# EAGLE design Main (EAGLE 9.1.3)
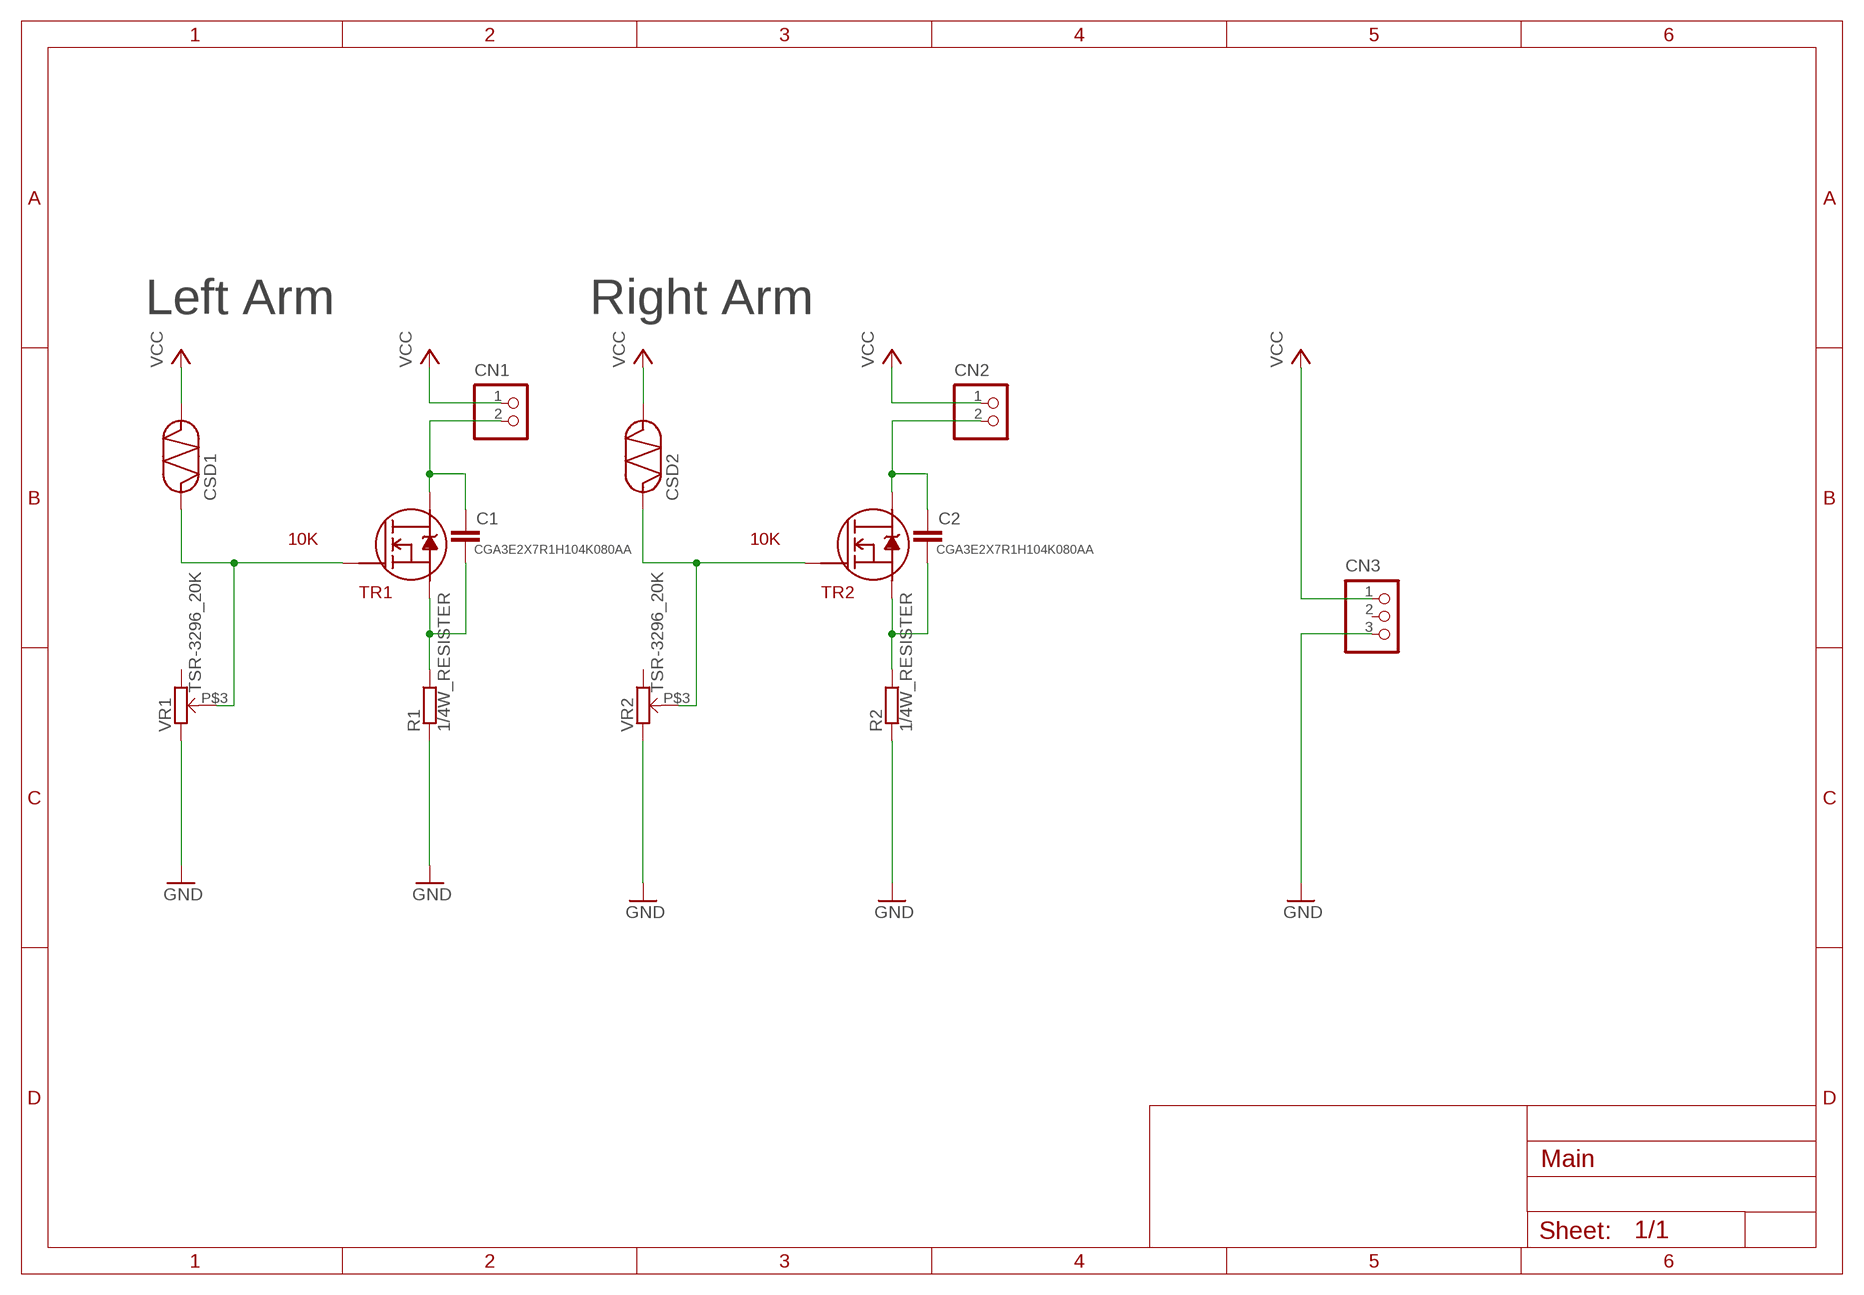
[diagram p0: schematic, sheet 1]

## Parts
C1  CGA3E2X7R1H104K080AA  [0603]
C2  CGA3E2X7R1H104K080AA  [0603]
CN1  B2B-XH-A  [B2B-XH-A]
CN2  B2B-XH-A  [B2B-XH-A]
CN3  B3B-XH-A  [B3B-XH-A]
CSD1  GL5528  [GL5528]
CSD2  GL5528  [GL5528]
R1  1/4W_RESISTER  [MF1/4]
R2  1/4W_RESISTER  [MF1/4]
TR1  RN5006  [SC-62]
TR2  RN5006  [SC-62]
VR1  TSR-3296_20K  [TSR-3296]
VR2  TSR-3296_20K  [TSR-3296]

## Nets
GND: CN3.3 R1.P$2 R2.P$2 VR1.P$2 VR2.P$2
N$1: C1.P$1 CN1.2 TR1.E(D)
N$2: C1.P$2 R1.P$1 TR1.C1(S) TR1.C2(S)
N$3: C2.P$1 CN2.2 TR2.E(D)
N$4: C2.P$2 R2.P$1 TR2.C1(S) TR2.C2(S)
N$8: CSD2.P$1 TR2.B(G) VR2.P$3
N$9: CSD1.P$1 TR1.B(G) VR1.P$3
VCC: CN1.1 CN2.1 CN3.1 CSD1.P$2 CSD2.P$2
Unconnected: CN3.2 VR1.P$1 VR2.P$1

## Notes on the sheet
- Left Arm | Right Arm
- 10K | 10K

## Library data of the parts
C1 C2 = TDK:CGA3E2X7R1H104K080AA: 0.1µF ±10% 50V セラミックコンデンサ X7R 0603（1608メートル法）
CN1 CN2 = jst-xh:B2B-XH-A: Wire-to-Board 2.5mm pitch top mount connector Source: http://www.jst-mfg.com/product/pdf/jpn/XH.pdf http://www.jst-mfg.com/product/detail.php?series=277
CN3 = jst-xh:B3B-XH-A: Wire-to-Board 2.5mm pitch top mount connector Source: http://www.jst-mfg.com/product/pdf/jpn/XH.pdf http://www.jst-mfg.com/product/detail.php?series=277
CSD1 CSD2 = Tr_EXT:GL5528
R1 R2 = Tr_EXT:1/4W_RESISTER
TR1 TR2 = Tr_EXT:RN5006
VR1 VR2 = Tr_EXT:TSR-3296_20K

## Board
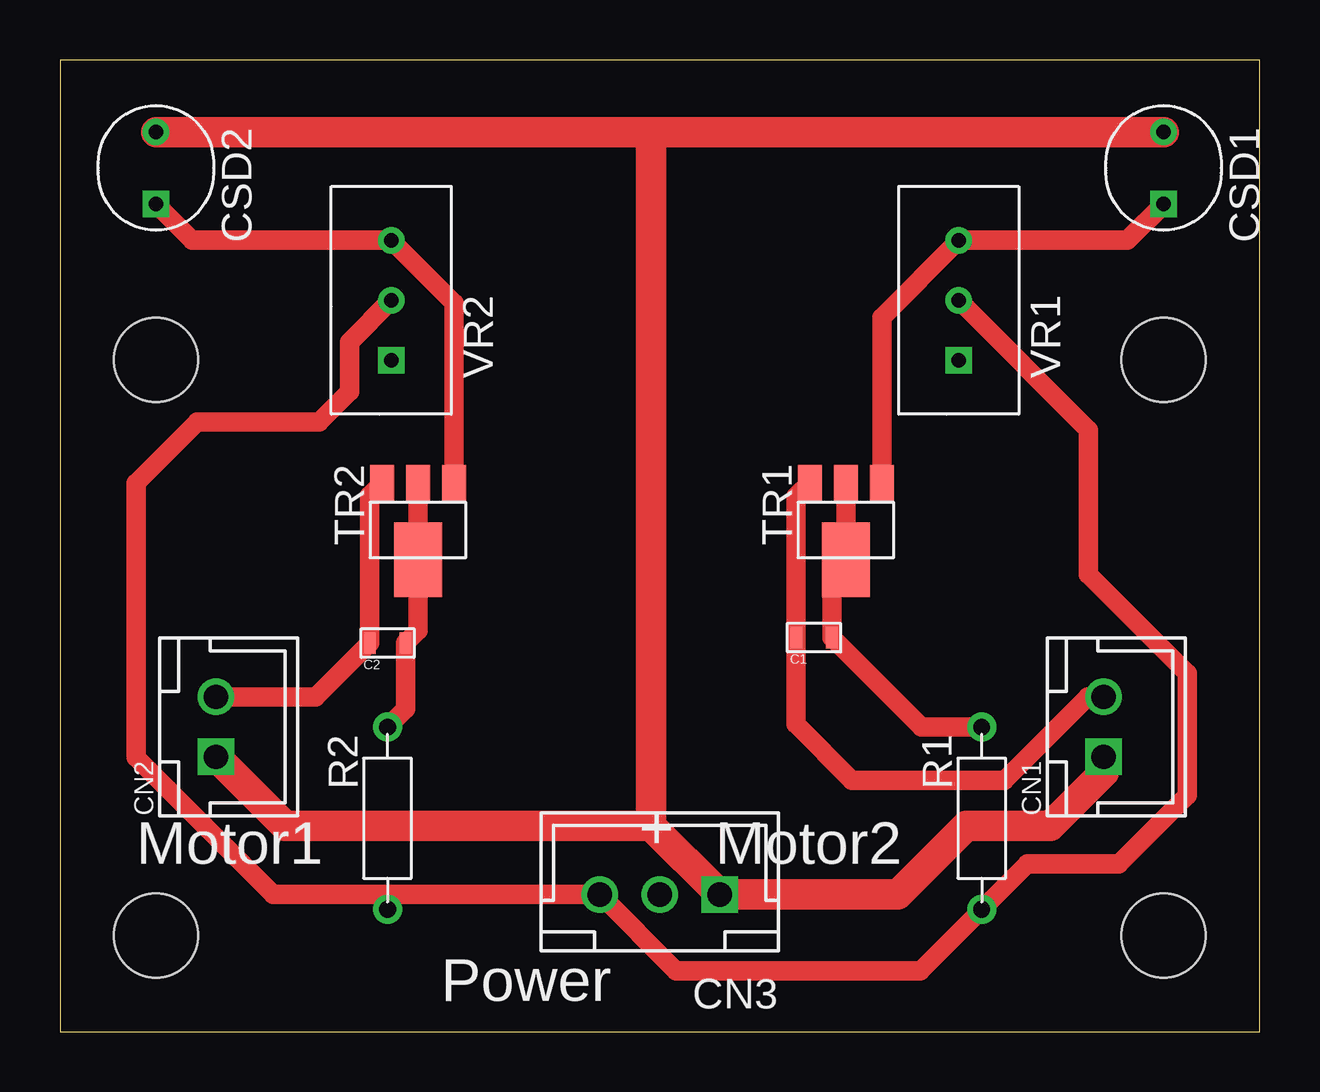
[diagram p1: board, top side]
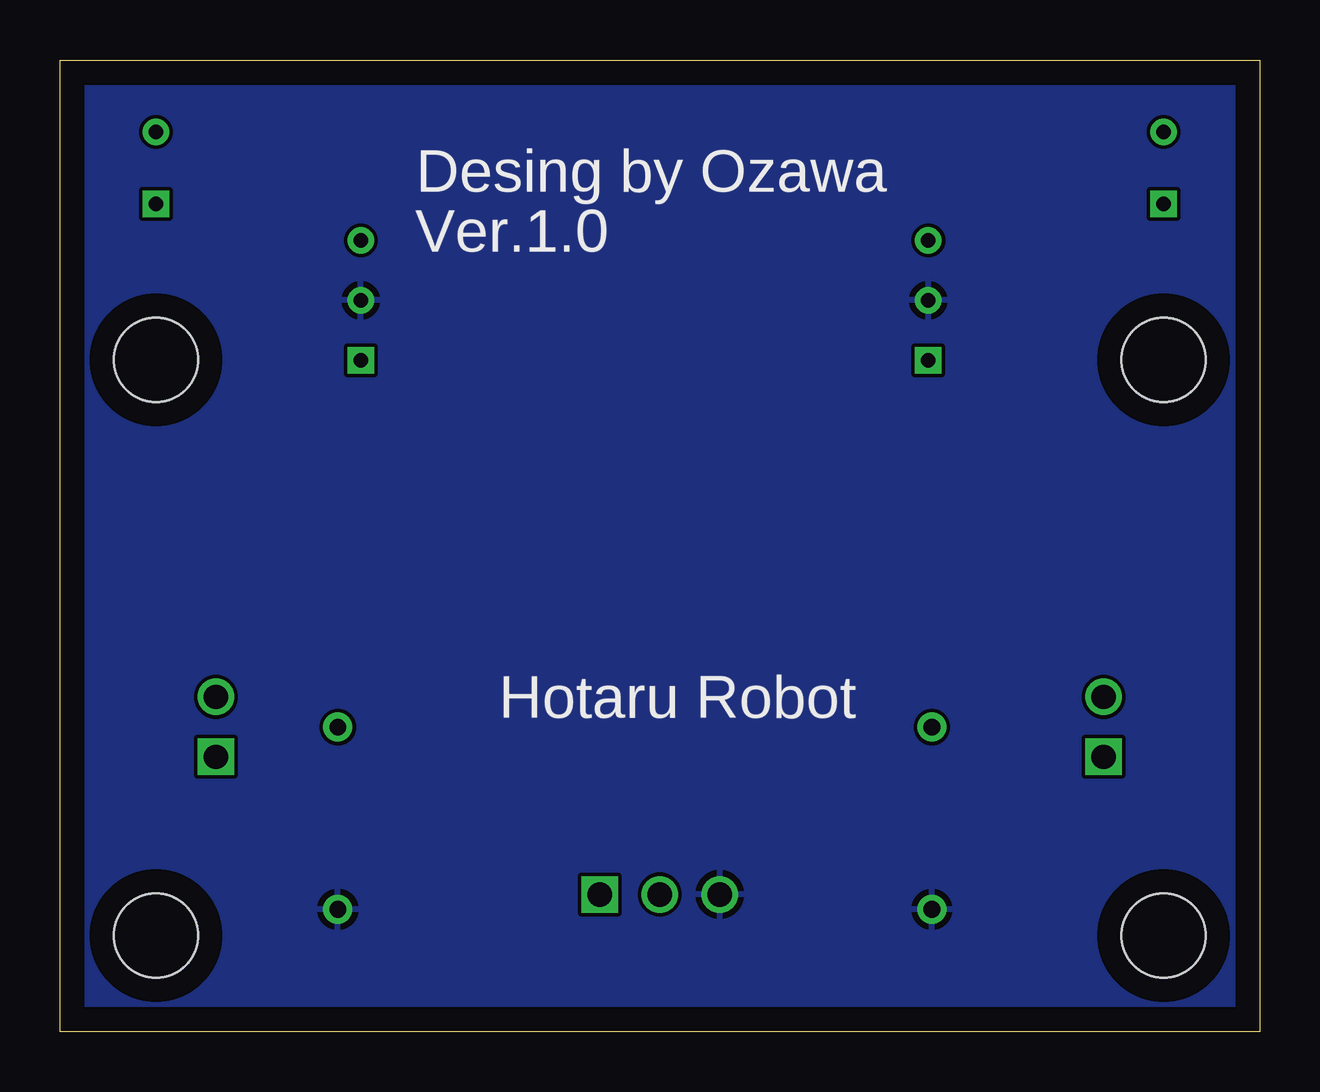
[diagram p2: board, bottom side, seen from below]

Size 50 x 40.5 mm. Coordinates in mm from the lower left corner, seen from the top.
Outline: 0,0 50,0 50,40.5 0,40.5 0,0
Copper layers (1*16): Top 0.035mm / dielectric 1.5mm / Bottom 0.035mm
Design rules "default": minimum track width 6mil, minimum drill 0.35mm, track to track 6mil, track to pad 6mil, pad to pad 6mil, via to via 6mil, smd to smd 6mil, copper to edge 40mil, drill to drill 6mil, minimum pad ring 10mil, minimum via ring 8mil, stop-mask expansion 4mil, vias tented up to drill 0mil, thermal gap 10mil
Holes 3.5 mm at 4,28 46,28 46,4 4,4

### Footprints (pad centres in the part's own frame; a part is rotated, then mirrored left to right if it is on the bottom)
0603 = smd 0.5 x 0.9: P$1 -0.75,0; P$2 0.75,0
B2B-XH-A = drill 1.016 square: 1 -1.25,0 | drill 1.016: 2 1.25,0
B3B-XH-A = drill 1.016 square: 1 -2.5,0 | drill 1.016: 2 0,0; 3 2.5,0
GL5528 = drill 0.6 square: P$1 -1.5,0 | drill 0.6: P$2 1.5,0
MF1/4 = drill 0.7: P$1 -3.8,0; P$2 3.8,0
SC-62 = smd 1 x 1.5: B -1.5,0; C1 0,0; E 1.5,0 | smd 2 x 3.1: C2 0,3.2
TSR-3296 = drill 0.6 square: P$1 -2.5,0 | drill 0.6: P$2 0,0; P$3 2.5,0

### Placement (x,y rotation side)
C1  31.43,16.42 0 top
C2  13.65,16.19 0 top
CN1  43.5,12.7 90 top
CN2  6.5,12.7 90 top
CN3  25,5.71 180 top
CSD1  46,36 90 top
CSD2  4,36 90 top
R1  38.42,8.89 270 top
R2  13.65,8.89 270 top
TR1  32.75,22.86 180 top
TR2  14.92,22.86 180 top
VR1  37.46,30.48 90 top
VR2  13.81,30.48 90 top

### Tracks (layer width: path | path; a pad name or v marks a point on that pad's centre or on a via)
GND
  Top 0.813: 13.65,5.71 CN3.3 25.68,2.54 35.87,2.54 R1.P$2 40.31,6.99 44.13,6.99 46.99,9.84 46.99,14.92 42.86,19.05 42.86,25.08 VR1.P$2 | R2.P$2 13.65,5.71 | 13.65,5.71 12.06,5.71 8.89,5.71 3.17,11.43 3.17,22.86 5.71,25.4 10.79,25.4 12.06,26.67 12.06,28.73 VR2.P$2
  pour Bottom: -5,20 -5,45 10,45 55,45 55,20 55,-5 35,-5 -5,-5
N$1
  Top 0.813: CN1.2 42.84,13.95 39.37,10.48 33.02,10.48 30.68,12.81 C1.P$1 30.68,22.29 TR1.E
N$2
  Top 0.813: R1.P$1 35.91,12.69 C1.P$2 32.18,19.09 TR1.C2 TR1.C1
N$3
  Top 0.813: TR2.E 12.9,22.34 C2.P$1 10.66,13.95 CN2.2
N$4
  Top 0.813: TR2.C1 TR2.C2 14.92,16.71 C2.P$2 14.4,13.44 R2.P$1
N$8
  Top 0.813: CSD2.P$1 5.52,32.98 13.94,32.98 VR2.P$3 16.42,30.37 TR2.B
N$9
  Top 0.813: CSD1.P$1 44.48,32.98 VR1.P$3 34.25,29.77 TR1.B
VCC
  Top 0.813: 24.13,37.5 24.42,37.21 24.64,37.21
  Top 1.27: CN1.1 43.5,10.8 41.27,8.57 37.78,8.57 34.92,5.71 CN3.1 24.64,8.57 | CN2.1 9.38,8.57 24.64,8.57 | 24.64,37.21 24.64,8.57 | CSD2.P$2 24.13,37.5 CSD1.P$2

### Text on the board
tPlace: + | Motor1 | Motor2 | Power
bPlace: Desing by Ozawa | Ver.1.0 | Hotaru Robot